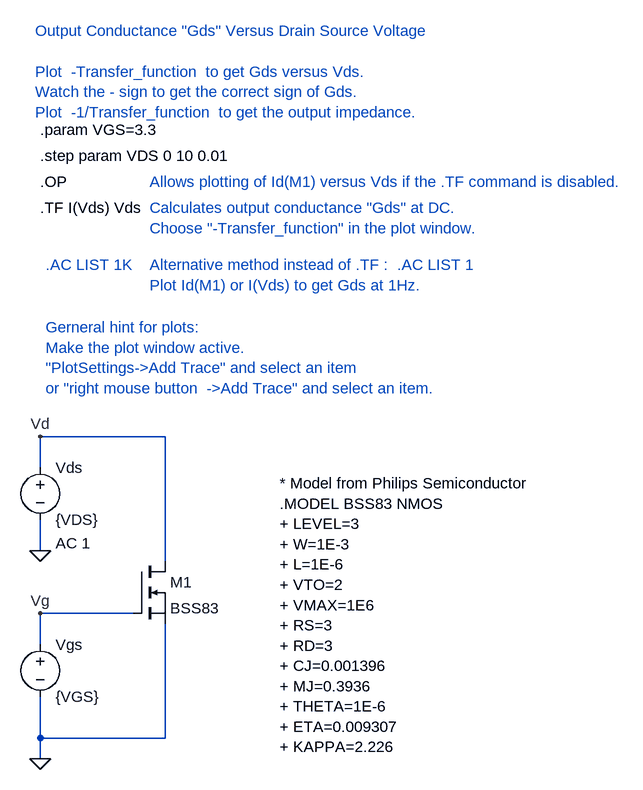
[diagram p0: schematic gds_of_vds_const_vgs.asc]
gds_of_vds_const_vgs.asc, the LTspice schematic file:
Version 4
SHEET 1 1208 724
WIRE -112 384 -112 336
WIRE 80 496 80 672
WIRE 80 672 -112 672
WIRE -112 528 -112 480
WIRE -112 608 -112 672
WIRE -112 704 -112 672
WIRE -112 256 -112 208
WIRE 32 480 -112 480
WIRE -112 208 80 208
WIRE 80 208 80 400
FLAG -112 704 0
FLAG -112 384 0
FLAG -112 208 Vd
FLAG -112 480 Vg
SYMBOL voltage -112 512 R0
WINDOW 123 24 132 Left 0
WINDOW 39 0 0 Left 0
SYMATTR InstName Vgs
SYMATTR Value {VGS}
SYMBOL voltage -112 240 R0
WINDOW 123 24 132 Left 0
WINDOW 39 0 0 Left 0
SYMATTR Value2 AC 1
SYMATTR InstName Vds
SYMATTR Value {VDS}
SYMBOL nmos 32 400 R0
SYMATTR InstName M1
SYMATTR Value BSS83
TEXT -112 -224 Left 0 !.step param VDS 0 10 0.01
TEXT -112 -184 Left 0 !.OP
TEXT -112 -144 Left 0 !.TF I(Vds) Vds
TEXT -104 -56 Left 0 ;.AC LIST 1K
TEXT 56 -56 Left 0 ;Alternative method instead of .TF :  .AC LIST 1\nPlot Id(M1) or I(Vds) to get Gds at 1Hz.
TEXT 56 -144 Left 0 ;Calculates output conductance "Gds" at DC.\nChoose "-Transfer_function" in the plot window.
TEXT 56 -184 Left 0 ;Allows plotting of Id(M1) versus Vds if the .TF command is disabled.
TEXT -120 -416 Left 0 ;Output Conductance "Gds" Versus Drain Source Voltage\n \nPlot  -Transfer_function  to get Gds versus Vds.  \nWatch the - sign to get the correct sign of Gds.\nPlot  -1/Transfer_function  to get the output impedance.
TEXT -104 40 Left 0 ;Gerneral hint for plots:\nMake the plot window active. \n"PlotSettings->Add Trace" and select an item\nor "right mouse button  ->Add Trace" and select an item.
TEXT -112 -264 Left 0 !.param VGS=3.3
TEXT 256 280 Left 0 !* Model from Philips Semiconductor\n.MODEL BSS83 NMOS\n+ LEVEL=3\n+ W=1E-3\n+ L=1E-6\n+ VTO=2\n+ VMAX=1E6\n+ RS=3\n+ RD=3\n+ CJ=0.001396\n+ MJ=0.3936\n+ THETA=1E-6\n+ ETA=0.009307\n+ KAPPA=2.226

The netlist it stands for:
* gds_of_vds_const_vgs.asc
Vgs Vg 0 {VGS}
Vds Vd 0 {VDS} AC 1
M1 Vd Vg 0 0 BSS83
.model NMOS NMOS
.model PMOS PMOS
.lib standard.mos
.step param VDS 0 10 0.01
.OP
.TF I(Vds) Vds
* .AC LIST 1K
* Alternative method instead of .TF :  .AC LIST 1
* Plot Id(M1) or I(Vds) to get Gds at 1Hz.
* Calculates output conductance "Gds" at DC.
* Choose "-Transfer_function" in the plot window.
* Allows plotting of Id(M1) versus Vds if the .TF command is disabled.
* Output Conductance "Gds" Versus Drain Source Voltage
* Plot  -Transfer_function  to get Gds versus Vds.
* Watch the - sign to get the correct sign of Gds.
* Plot  -1/Transfer_function  to get the output impedance.
* Gerneral hint for plots:
* Make the plot window active.
* "PlotSettings->Add Trace" and select an item
* or "right mouse button  ->Add Trace" and select an item.
.param VGS=3.3
* Model from Philips Semiconductor
.MODEL BSS83 NMOS
+ LEVEL=3
+ W=1E-3
+ L=1E-6
+ VTO=2
+ VMAX=1E6
+ RS=3
+ RD=3
+ CJ=0.001396
+ MJ=0.3936
+ THETA=1E-6
+ ETA=0.009307
+ KAPPA=2.226
.backanno
.end